# Altium schematic sheet Sheet2.SchDoc
size A3
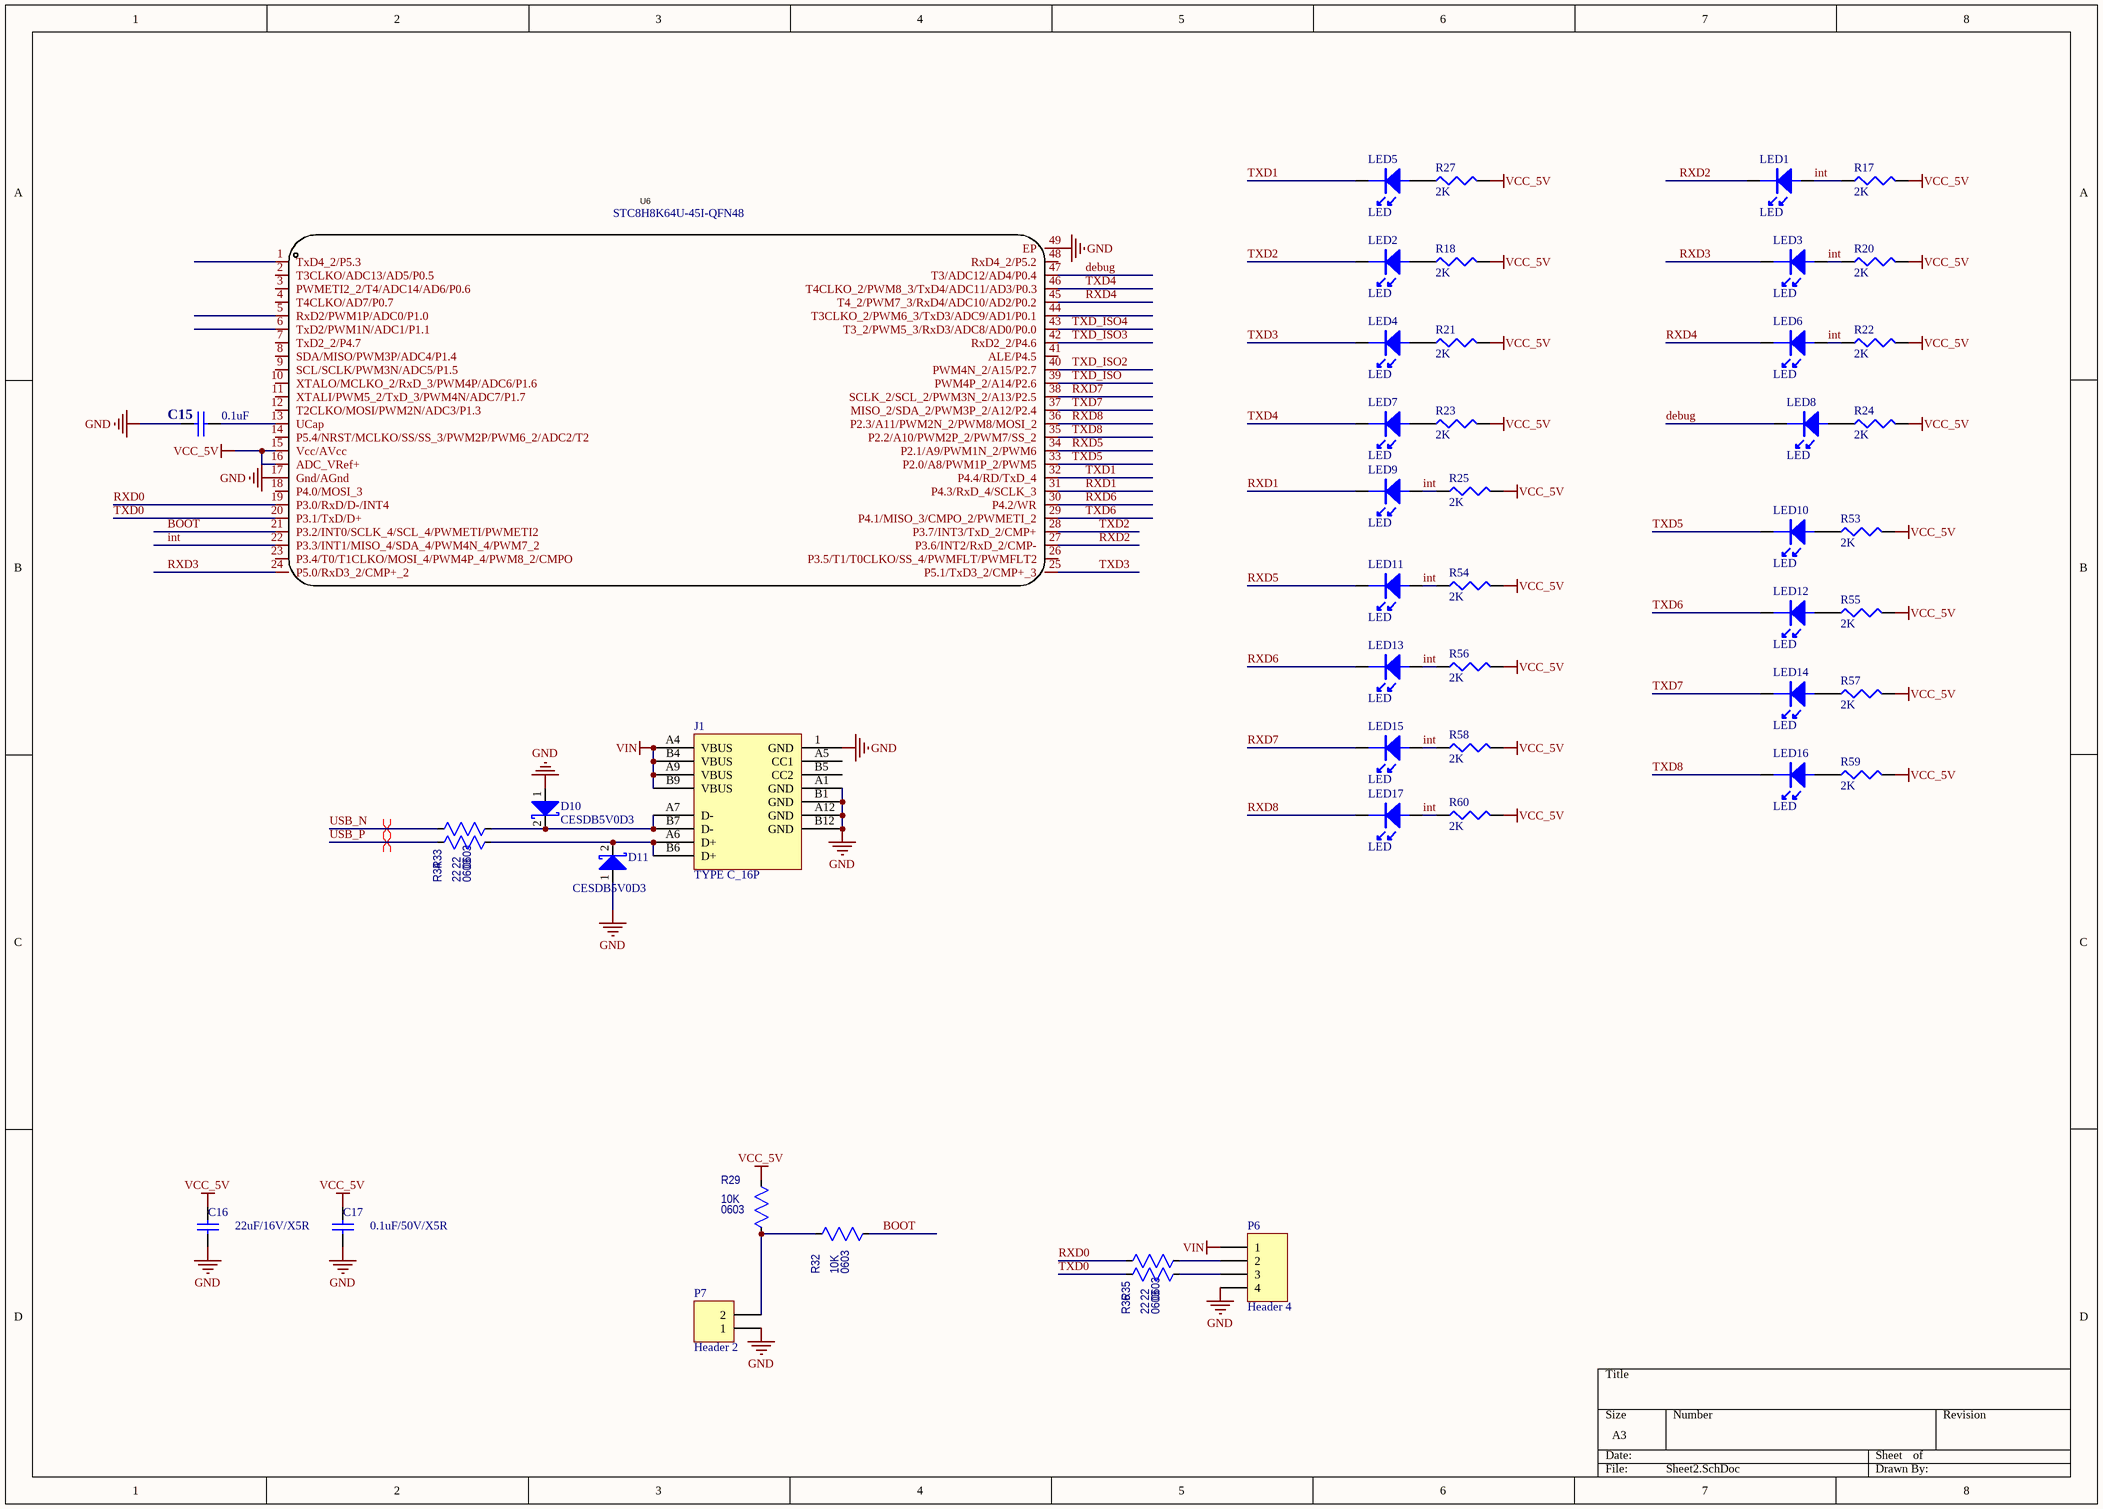
[diagram p0: Sheet2.SchDoc]

## Parts
C15  0.1uF  [0603C]
C16  22uF/16V/X5R  [0805C]
C17  0.1uF/50V/X5R  [0603C]
D10  CESDB5V0D3  [SOD323]
D11  CESDB5V0D3  [SOD323]
J1  TYPE C_16P  [TYPEC_16P]
LED1  LED  [0603LED]
LED2  LED  [0603LED]
LED3  LED  [0603LED]
LED4  LED  [0603LED]
LED5  LED  [0603LED]
LED6  LED  [0603LED]
LED7  LED  [0603LED]
LED8  LED  [0603LED]
LED9  LED  [0603LED]
LED10  LED  [0603LED]
LED11  LED  [0603LED]
LED12  LED  [0603LED]
LED13  LED  [0603LED]
LED14  LED  [0603LED]
LED15  LED  [0603LED]
LED16  LED  [0603LED]
LED17  LED  [0603LED]
P6  Header 4  [HDR1X4]
P7  Header 2  [HDR1X2]
R17  2K  [0603R]
R18  2K  [0603R]
R20  2K  [0603R]
R21  2K  [0603R]
R22  2K  [0603R]
R23  2K  [0603R]
R24  2K  [0603R]
R25  2K  [0603R]
R27  2K  [0603R]
R29  Package: 0603  [0603r]  (hidden comment: 10k)
R32  Package: 0603  [0603r]  (hidden comment: 10k)
R33  value 22  Package: 0603  [0603r]  (hidden comment: 10k)
R34  value 22  Package: 0603  [0603r]  (hidden comment: 10k)
R35  value 22  Package: 0603  [0603r]  (hidden comment: 10k)
R36  value 22  Package: 0603  [0603r]  (hidden comment: 10k)
R53  2K  [0603R]
R54  2K  [0603R]
R55  2K  [0603R]
R56  2K  [0603R]
R57  2K  [0603R]
R58  2K  [0603R]
R59  2K  [0603R]
R60  2K  [0603R]
U6  STC8H8K64U-45I-QFN48  [QFN-48_L6.0-W6.0-P0.40-TL-EP4.4]

## Nets
GND: C15.1 C16.1 C17.1 D10.1(A) D11.1(A) J1.1(GND) J1.A1(GND) J1.A12(GND) J1.B1(GND) J1.B12(GND) P6.4 P7.1 U6.17(Gnd/AGnd) U6.49(EP)
VCC_5V: C16.2 C17.2 R17.2 R18.2 R20.2 R21.2 R22.2 R23.2 R24.2 R25.2 R27.2 R29.1 R53.2 R54.2 R55.2 R56.2 R57.2 R58.2 R59.2 R60.2 U6.15(Vcc/AVcc) U6.16(ADC_VRef+)
VIN: J1.A4(VBUS) J1.A9(VBUS) J1.B4(VBUS) J1.B9(VBUS) P6.1
BOOT: R32.2 U6.21(P3.2/INT0/SCLK_4/SCL_4/PWMETI/PWMETI2)
debug: LED8.2 U6.47(T3/ADC12/AD4/P0.4)
int: LED1.1 LED3.1 LED6.1 LED9.1 LED11.1 LED13.1 LED15.1 LED17.1 R17.1 R20.1 R22.1 R25.1 R54.1 R56.1 R58.1 R60.1 U6.22(P3.3/INT1/MISO_4/SDA_4/PWM4N_4/PWM7_2)
RXD0: R35.1 U6.19(P3.0/RxD/D-/INT4)
RXD1: LED9.2 U6.31(P4.3/RxD_4/SCLK_3)
RXD2: LED1.2 U6.27(P3.6/INT2/RxD_2/CMP-)
RXD3: LED3.2 U6.24(P5.0/RxD3_2/CMP+_2)
RXD4: LED6.2 U6.45(T4_2/PWM7_3/RxD4/ADC10/AD2/P0.2)
RXD5: LED11.2 U6.34(P2.1/A9/PWM1N_2/PWM6)
RXD6: LED13.2 U6.30(P4.2/WR)
RXD7: LED15.2 U6.38(SCLK_2/SCL_2/PWM3N_2/A13/P2.5)
RXD8: LED17.2 U6.36(P2.3/A11/PWM2N_2/PWM8/MOSI_2)
TXD0: R36.1 U6.20(P3.1/TxD/D+)
TXD1: LED5.2 U6.32(P4.4/RD/TxD_4)
TXD2: LED2.2 U6.28(P3.7/INT3/TxD_2/CMP+)
TXD3: LED4.2 U6.25(P5.1/TxD3_2/CMP+_3)
TXD4: LED7.2 U6.46(T4CLKO_2/PWM8_3/TxD4/ADC11/AD3/P0.3)
TXD5: LED10.2 U6.33(P2.0/A8/PWM1P_2/PWM5)
TXD6: LED12.2 U6.29(P4.1/MISO_3/CMPO_2/PWMETI_2)
TXD7: LED14.2 U6.37(MISO_2/SDA_2/PWM3P_2/A12/P2.4)
TXD8: LED16.2 U6.35(P2.2/A10/PWM2P_2/PWM7/SS_2)
TXD_ISO: U6.39(PWM4P_2/A14/P2.6)
TXD_ISO2: U6.40(PWM4N_2/A15/P2.7)
TXD_ISO3: U6.42(RxD2_2/P4.6)
TXD_ISO4: U6.43(T3_2/PWM5_3/RxD3/ADC8/AD0/P0.0)
USB_N: R33.1
USB_P: R34.1
NetC15_2: C15.2 U6.13(UCap)
NetD10_2: D10.2(K) J1.A7(D-) J1.B7(D-) R33.2
NetD11_2: D11.2(K) J1.A6(D+) J1.B6(D+) R34.2
NetLED2_1: LED2.1 R18.1
NetLED4_1: LED4.1 R21.1
NetLED5_1: LED5.1 R27.1
NetLED7_1: LED7.1 R23.1
NetLED8_1: LED8.1 R24.1
NetLED10_1: LED10.1 R53.1
NetLED12_1: LED12.1 R55.1
NetLED14_1: LED14.1 R57.1
NetLED16_1: LED16.1 R59.1
NetP6_2: P6.2 R35.2
NetP6_3: P6.3 R36.2
NetP7_2: P7.2 R29.2 R32.1

Not connected (* = marked no-connect by the designer): J1 A5(CC1) B5(CC2); U6 1(TxD4_2/P5.3) 2(T3CLKO/ADC13/AD5/P0.5) 3(PWMETI2_2/T4/ADC14/AD6/P0.6) 4(T4CLKO/AD7/P0.7) 5(RxD2/PWM1P/ADC0/P1.0) 6(TxD2/PWM1N/ADC1/P1.1) 7(TxD2_2/P4.7) 8(SDA/MISO/PWM3P/ADC4/P1.4) 9(SCL/SCLK/PWM3N/ADC5/P1.5) 10(XTALO/MCLKO_2/RxD_3/PWM4P/ADC6/P1.6) 11(XTALI/PWM5_2/TxD_3/PWM4N/ADC7/P1.7) 12(T2CLKO/MOSI/PWM2N/ADC3/P1.3) 14(P5.4/NRST/MCLKO/SS/SS_3/PWM2P/PWM6_2/ADC2/T2) 18(P4.0/MOSI_3) 23(P3.4/T0/T1CLKO/MOSI_4/PWM4P_4/PWM8_2/CMPO) 26(P3.5/T1/T0CLKO/SS_4/PWMFLT/PWMFLT2) 41(ALE/P4.5) 44(T3CLKO_2/PWM6_3/TxD3/ADC9/AD1/P0.1) 48(RxD4_2/P5.2)

## Layout directives
differential pair: USB_N, USB_P

## Library data of the parts
C15 = CAP: Capacitor
C16 C17 = CAP4: 贴片电容 20%
D10 D11 = DIODE S: Schottky Diode
P6 = Header 4: Header, 4-Pin; LatestRevisionDate: 17-Jul-2002; LatestRevisionNote: Re-released for DXP Platform.; Publisher: Altium Limited
P7 = Header 2: Header, 2-Pin; LatestRevisionDate: 17-Jul-2002; LatestRevisionNote: Re-released for DXP Platform.; Publisher: Altium Limited
R17 R18 R20-R25 R27 R53-R60 = RES1: P: 1/8W
R29 R32-R36 = Resistor_0603: PartNumber: RC0603FR-071KL; Power Rating: [power]; TempCo: [tempco]; Tolerance: tol; SupplierDescription: RES SMD 1K OHM 1% 1/10W 0603
  R29 R32: Value: 10K
U6 = STC8H8K64U-45I-QFN48: Add into BOM: yes; Symbol: STC8H8K64U-45I-QFN48; Device: STC8H8K64U-45I-QFN48; Supplier Part: C5339175; Manufacturer Part: STC8H8K64U-45I-QFN48; Supplier Footprint: QFN-48(6x6); JLCPCB Part Class: Extended Part; Datasheet: https://atta.szlcsc.com/upload/public/pdf/source/20240415/6EBDADF517194314A061D0AE8E2F25D8.pdf; Supplier: LCSC; Convert to PCB: yes